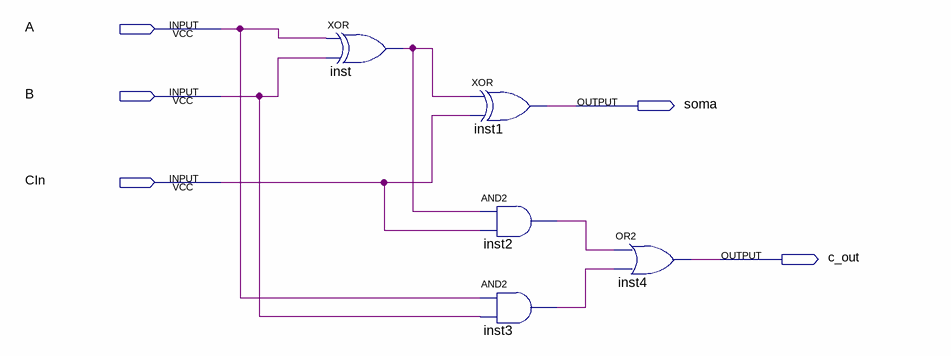
[diagram p0: schematic sheet]
// Quartus schematic somador.bdf as structural Verilog: 5 symbols, 5 pins
module somador (
  input  A,
  input  B,
  input  CIn,
  output soma,
  output c_out
);

  wire inst2_out, inst3_out, inst_out;

  xor inst (inst_out, A, B);
  xor inst1 (soma, inst_out, CIn);
  and inst2 (inst2_out, inst_out, CIn);
  and inst3 (inst3_out, A, B);
  or inst4 (c_out, inst2_out, inst3_out);
endmodule
